# EAGLE schematic inverter (EAGLE 9.3.2)
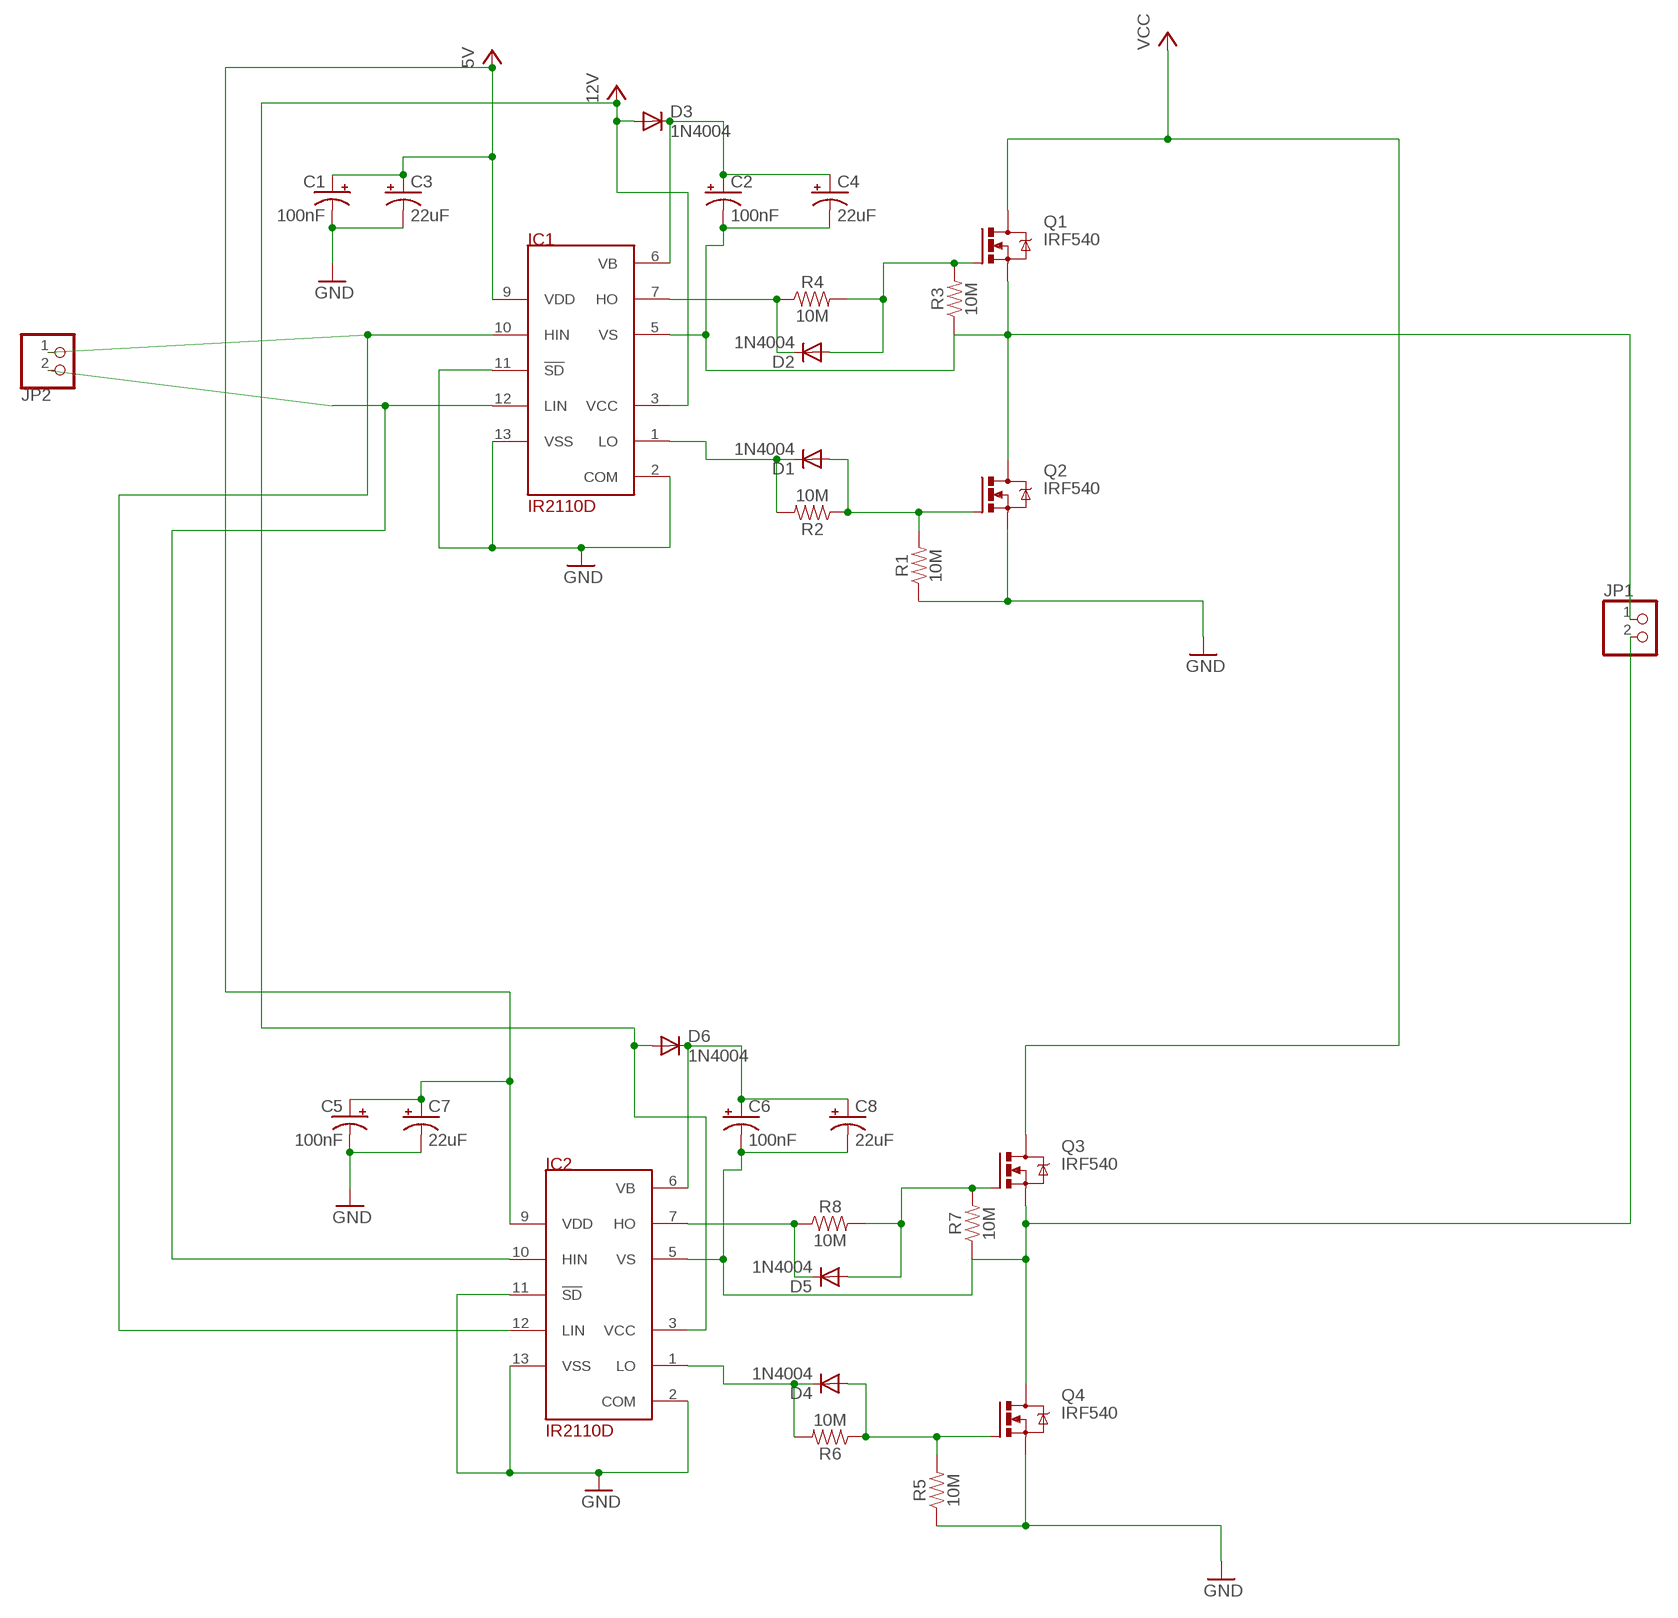
[diagram p0: schematic, sheet 1]

## Parts
C1  100nF  CPOL-USE2.5-5  [E2,5-5]
C2  100nF  CPOL-USE2.5-5  [E2,5-5]
C3  22uF  CPOL-USE3.5-10  [E3,5-10]
C4  22uF  CPOL-USE3.5-10  [E3,5-10]
C5  100nF  CPOL-USE2.5-5  [E2,5-5]
C6  100nF  CPOL-USE2.5-5  [E2,5-5]
C7  22uF  CPOL-USE3.5-10  [E3,5-10]
C8  22uF  CPOL-USE3.5-10  [E3,5-10]
D1  1N4004  [DO41-10]
D2  1N4004  [DO41-10]
D3  1N4004  [DO41-10]
D4  1N4004  [DO41-10]
D5  1N4004  [DO41-10]
D6  1N4004  [DO41-10]
IC1  IR2110D  [DIL14]
IC2  IR2110D  [DIL14]
JP1  PINHD-1X2  [1X02]
JP2  PINHD-1X2  [1X02]
Q1  IRF540  [TO220BV]
Q2  IRF540  [TO220BV]
Q3  IRF540  [TO220BV]
Q4  IRF540  [TO220BV]
R1  10M  10MOHM-HORIZ-1/4W-5%  [AXIAL-0.3]
R2  10M  10MOHM-HORIZ-1/4W-5%  [AXIAL-0.3]
R3  10M  10MOHM-HORIZ-1/4W-5%  [AXIAL-0.3]
R4  10M  10MOHM-HORIZ-1/4W-5%  [AXIAL-0.3]
R5  10M  10MOHM-HORIZ-1/4W-5%  [AXIAL-0.3]
R6  10M  10MOHM-HORIZ-1/4W-5%  [AXIAL-0.3]
R7  10M  10MOHM-HORIZ-1/4W-5%  [AXIAL-0.3]
R8  10M  10MOHM-HORIZ-1/4W-5%  [AXIAL-0.3]

## Nets
COM: IC1.2(COM) IC1.11(!SD) IC1.13(VSS) IC2.2(COM) IC2.11(!SD) IC2.13(VSS) ; supply symbol labelled GND
GND: C1.- C3.- C5.- C7.- Q2.S Q4.S R1.P$1 R5.P$1
N$1: IC1.12(LIN) IC2.10(HIN) JP2.2
N$2: D2.A Q1.G R3.P$2 R4.P$2
N$3: D1.A Q2.G R1.P$2 R2.P$1
N$4: D1.C IC1.1(LO) R2.P$2
N$5: D2.C IC1.7(HO) R4.P$1
N$6: IC1.10(HIN) IC2.12(LIN) JP2.1
N$7: D5.A Q3.G R7.P$2 R8.P$2
N$10: D5.C IC2.7(HO) R8.P$1
N$11: D4.A Q4.G R5.P$2 R6.P$1
N$12: D4.C IC2.1(LO) R6.P$2
VB: C2.+ C4.+ C6.+ C8.+ D3.C D6.C IC1.6(VB) IC2.6(VB)
VCC: D3.A D6.A IC1.3(VCC) IC2.3(VCC) Q1.D Q3.D ; supply symbol labelled 12V
VDD: C1.+ C3.+ C5.+ C7.+ IC1.9(VDD) IC2.9(VDD) ; supply symbol labelled 5V
VS: C2.- C4.- C6.- C8.- IC1.5(VS) IC2.5(VS) JP1.1 JP1.2 Q1.S Q2.D Q3.S Q4.D R3.P$1 R7.P$1

## Library data of the parts
C1-C8 = adafruit:CPOL-US: POLARIZED CAPACITOR, American symbol
D1-D6 = adafruit:1N4004: DIODE General purpose 1N400x type rectifier (With bigger pads) http://www.ladyada.net/library/pcb/eaglelibrary.html
IC1 IC2 = irs:IR2110
JP1 JP2 = pinhead:PINHD-1X2: PIN HEADER
Q1-Q4 = transistor-power:IRF540: HEXFET Power MOSFET
R1-R8 = SparkFun-Resistors:10MOHM: RES-09327; PROD_ID: RES-09327